# EasyEDA Pro project ACDC_双向.eprj, schematic 三相（TO-277）
Board Name: 三相（TO-277）; Create Date: 2025-07-25; Page Name: P1; Project Name: ACDC_双向; Schematic Name: Schematic3_2; Update Date: 2025-07-25; Company: 嘉立创EDA; Page Size: A4; Version: V1.0
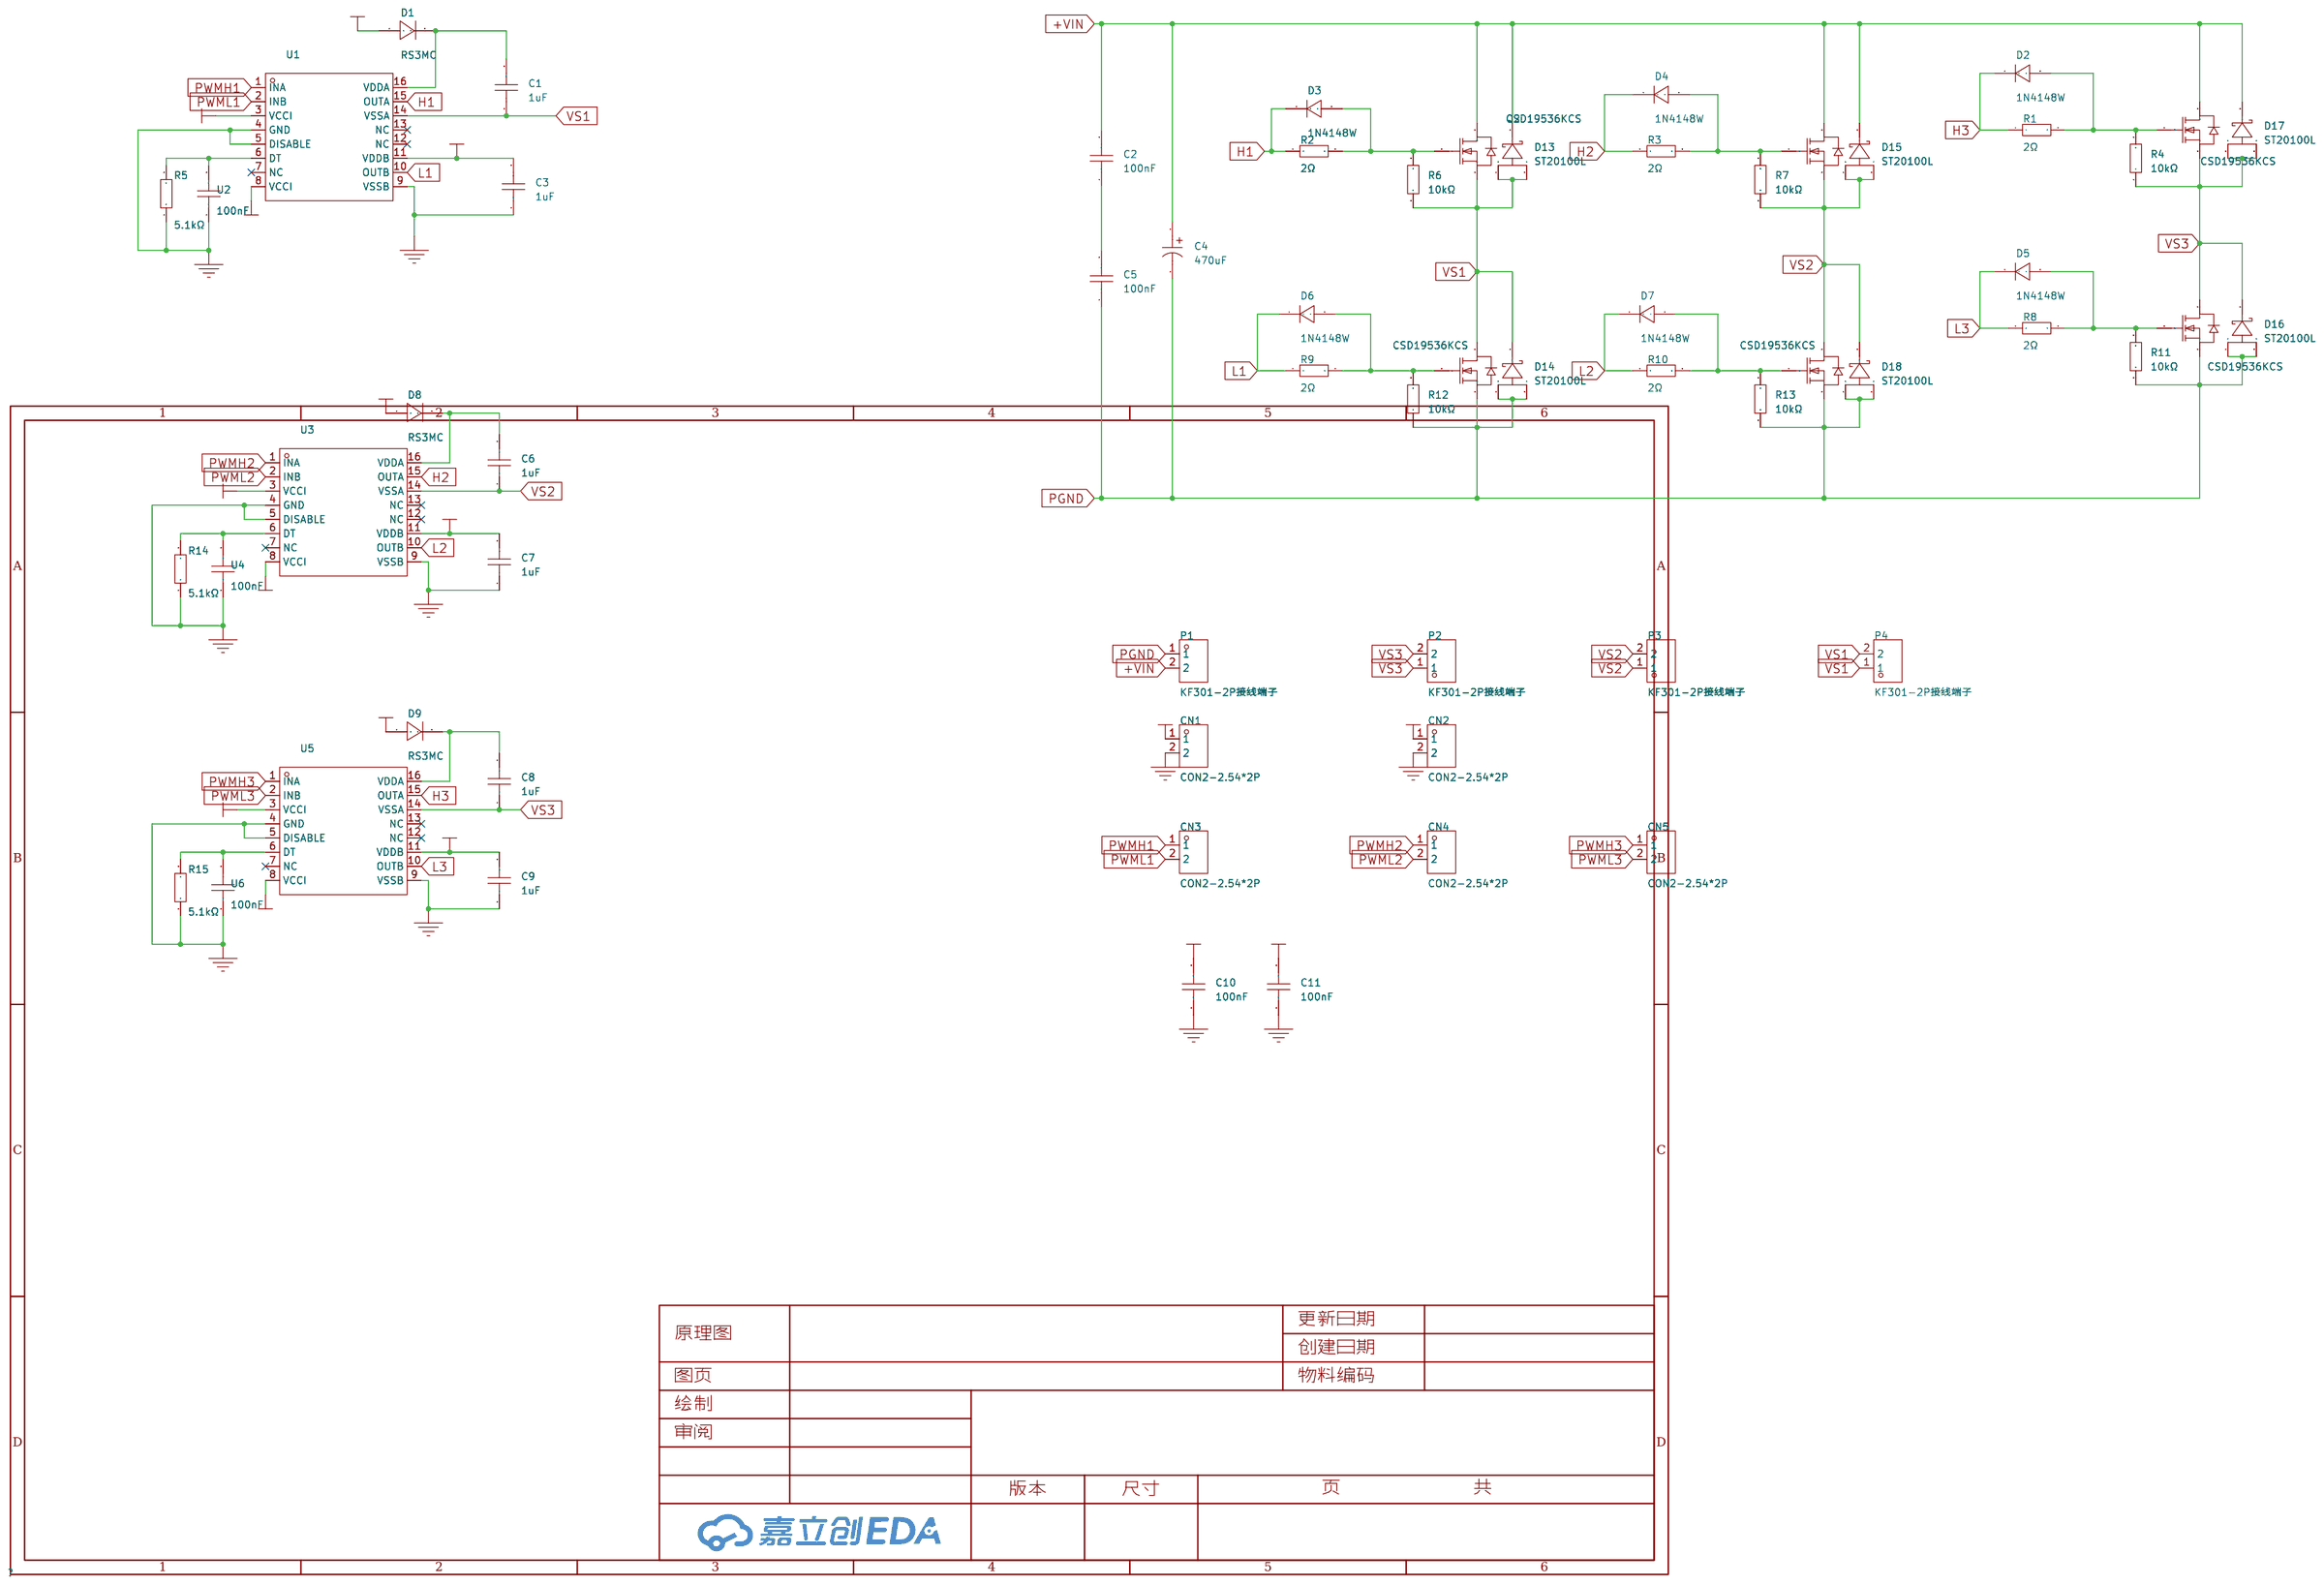
[diagram p3: schematic sheet]

## Parts
C1  1uF  [C0805]
C2  100nF  [C0805]
C3  1uF  [C0805]
C4  470uF  [CAP-TH_BD16.0-P7.50-D1.2-FD]
C5  100nF  [C0805]
C6  1uF  [C0805]
C7  1uF  [C0805]
C8  1uF  [C0805]
C9  1uF  [C0805]
C10  100nF  [C0805]
C11  100nF  [C0805]
CN1  CON2-2.54*2P  [CONN-TH_2P-P2.54-V]
CN2  CON2-2.54*2P  [CONN-TH_2P-P2.54-V]
CN3  CON2-2.54*2P  [CONN-TH_2P-P2.54-V]
CN4  CON2-2.54*2P  [CONN-TH_2P-P2.54-V]
CN5  CON2-2.54*2P  [CONN-TH_2P-P2.54-V]
D1  RS3MC  [SMC_L7.1-W6.2-LS8.1-R-RD]
D2  1N4148W  [SOD-123F_L2.7-W1.6-LS3.8-RD]
D3  1N4148W  [SOD-123F_L2.7-W1.6-LS3.8-RD]
D4  1N4148W  [SOD-123F_L2.7-W1.6-LS3.8-RD]
D5  1N4148W  [SOD-123F_L2.7-W1.6-LS3.8-RD]
D6  1N4148W  [SOD-123F_L2.7-W1.6-LS3.8-RD]
D7  1N4148W  [SOD-123F_L2.7-W1.6-LS3.8-RD]
D8  RS3MC  [SMC_L7.1-W6.2-LS8.1-R-RD]
D9  RS3MC  [SMC_L7.1-W6.2-LS8.1-R-RD]
D13  ST20100L  [TO-277_3P-L5.7-W4.2-LS6.5-BR]
D14  ST20100L  [TO-277_3P-L5.7-W4.2-LS6.5-BR]
D15  ST20100L  [TO-277_3P-L5.7-W4.2-LS6.5-BR]
D16  ST20100L  [TO-277_3P-L5.7-W4.2-LS6.5-BR]
D17  ST20100L  [TO-277_3P-L5.7-W4.2-LS6.5-BR]
D18  ST20100L  [TO-277_3P-L5.7-W4.2-LS6.5-BR]
P1  KF301-2P接线端子  [CONN-TH_XY301V-A-5.0-2P]
P2  KF301-2P接线端子  [CONN-TH_XY301V-A-5.0-2P]
P3  KF301-2P接线端子  [CONN-TH_XY301V-A-5.0-2P]
P4  KF301-2P接线端子  [CONN-TH_XY301V-A-5.0-2P]
Q1  CSD19536KCS  [TO-220-3_L10.0-W4.5-P2.54-L]
Q2  CSD19536KCS  [TO-220-3_L10.0-W4.5-P2.54-L]
Q3  CSD19536KCS  [TO-220-3_L10.0-W4.5-P2.54-L]
Q4  CSD19536KCS  [TO-220-3_L10.0-W4.5-P2.54-L]
Q5  CSD19536KCS  [TO-220-3_L10.0-W4.5-P2.54-L]
Q6  CSD19536KCS  [TO-220-3_L10.0-W4.5-P2.54-L]
R1  2Ω  [R0805]
R2  2Ω  [R0805]
R3  2Ω  [R0805]
R4  10kΩ  [R0805]
R5  20kΩ  [R0805]
R6  10kΩ  [R0805]
R7  10kΩ  [R0805]
R8  2Ω  [R0805]
R9  2Ω  [R0805]
R10  2Ω  [R0805]
R11  10kΩ  [R0805]
R12  10kΩ  [R0805]
R13  10kΩ  [R0805]
R14  20kΩ  [R0805]
R15  20kΩ  [R0805]
U1  UCC21520  [SOIC-16_L10.3-W7.5-P1.27-LS10.3-BL]
U2  100nF  [C0805]
U3  UCC21520  [SOIC-16_L10.3-W7.5-P1.27-LS10.3-BL]
U4  100nF  [C0805]
U5  UCC21520  [SOIC-16_L10.3-W7.5-P1.27-LS10.3-BL]
U6  100nF  [C0805]

## Library data of the parts
C1-C3 C5-C11 = CAP_0805: Supplier Footprint: 0805
C4 = CD11Z 100V470μF: LCSC Part Name: 470uF 100V; Supplier Part: C1692765; Manufacturer: DMEGC(东磁); Supplier Footprint: 插件,D16xL25mm; JLCPCB Part Class: 扩展库; Datasheet: https://atta.szlcsc.com/upload/public/pdf/source/20210111/C1692765_3DA9E861BF574BA4CB3EF792989E2CF7.pdf; Supplier: LCSC; Rated Voltage: 100V
CN1-CN5 = CON2-2.54*2P: Supplier Part: C9900003238; Supplier Footprint: TH-2P; JLCPCB Part Class: Extended Part; Supplier: LCSC
D1 D8 D9 = RS3MC_C15283: LCSC Part Name: 电压:1kV 电流:3A; Supplier Part: C15283; Manufacturer: MDD(辰达半导体); Supplier Footprint: SMC; JLCPCB Part Class: 扩展库; Datasheet: https://atta.szlcsc.com/upload/public/pdf/source/20240809/311FA8487617F5AA976E3BC15CA3A541.pdf; Supplier: LCSC; Diode Configuration: 独立式; Forward Voltage (Vf@If): 1.3V@3A; Reverse Voltage (Vr): 1kV; Rectified Current: 3A; Reverse Leakage Current: 5uA@1kV; Reverse Recovery Time (trr): 500ns; Operating Temperature: -55℃~+150℃@(Tj)
D2-D7 = 1N4148W_C81598: 二极管配置:独立式;正向压降(Vf):1V@50mA;直流反向耐压(Vr):75V;平均整流电流(Io):150mA;功率:400mW;反向恢复时间(trr):4ns;; LCSC Part Name: 电压:75V 电流:150mA; Supplier Part: C81598; Manufacturer: ST(先科); Supplier Footprint: SOD-123; JLCPCB Part Class: Basic Part; Datasheet: https://atta.szlcsc.com/upload/public/pdf/source/20161024/1477288446905.pdf; Supplier: LCSC; Diode Configuration: 独立式; Forward Voltage (Vf@If): 1V@50mA; Reverse Voltage (Vr): 75V; Average Rectified Current (Io): 150mA; Power Dissipation: 400mW; Reverse Leakage Current: 1uA@75V; Reverse Recovery Time (trr): 4ns
D13-D18 = ST20100L: LCSC Part Name: 电压:100V 电流:20A; Supplier Part: C2693410; Manufacturer: CJ(江苏长电/长晶); Supplier Footprint: TO-277; JLCPCB Part Class: 扩展库; Datasheet: https://atta.szlcsc.com/upload/public/pdf/source/20210330/C2693410_9551F5ED840A67394421895091158B3C.pdf; Supplier: LCSC; Diode Configuration: 独立式; Voltage - Forward(Vf@If): 650mV@20A; Voltage - DC Reverse(Vr): 100V; Current - Rectified: 20A; Reverse Leakage Current (Ir): 30uA@100V
P1-P4 = KF301-2P接线端子: Supplier Part: C9900016950; Supplier Footprint: CK301-2P; JLCPCB Part Class: 扩展库; Supplier: LCSC
Q1-Q6 = CSD19536KCS: 类型:1个N沟道;漏源电压(Vdss):100V;连续漏极电流(Id):150A;功率(Pd):375W;导通电阻(RDS(on)@Vgs,Id):2.7mΩ@10V,100A;阈值电压(Vgs(th)@Id):3.2V@250uA;; LCSC Part Name: 1个N沟道 耐压:100V 电流:150A; Supplier Part: C206030; Manufacturer: TI(德州仪器); Supplier Footprint: TO-220; JLCPCB Part Class: 扩展库; Datasheet: https://www.ti.com/cn/lit/gpn/csd19536kcs; Supplier: LCSC; Type: 1个N沟道; Drain Source Voltage (Vdss): 100V; Continuous Drain Current (Id): 150A; Power Dissipation (Pd): 375W; Drain Source On Resistance (RDS(on)@Vgs,Id): 2.7mΩ@10V,100A; Gate Threshold Voltage (Vgs(th)@Id): 3.2V@250uA; Total Gate Charge (Qg@Vgs): 153nC@10V; Input Capacitance (Ciss@Vds): 12nF@50V; Operating Temperature: -55℃~+175℃@(Tj)
R1-R4 R6-R13 = Res_AXIAL-1/8W: Supplier Footprint: 轴向引线
R5 R14 R15 = 20kΩ: 电阻类型:金属膜电阻;阻值:20kΩ;精度:±1%;功率:500mW;温度系数:±50ppm/℃;; LCSC Part Name: 金属膜电阻 20kΩ ±1% 500mW; Supplier Part: C173146; Manufacturer: YAGEO(国巨); Manufacturer Part: MFR50SFTE52-20K; Supplier Footprint: 插件,D2.4xL6.3mm; JLCPCB Part Class: 扩展库; Datasheet: https://atta.szlcsc.com/upload/public/pdf/source/20191118/C457825_18355E864DE4965678DC27B0EBC3E21E.pdf; Supplier: LCSC; Type: 金属膜电阻; Tolerance: ±1%; Power(Watts): 500mW; Temperature Coefficient: ±50ppm/℃; Operating Temperature Range: -55℃~+155℃; Origin Footprint 2: RES-TH_BD2.4-L6.3-P10.30-D0.6; Origin Footprint 1: MFR50SFTE52-20K
U1 U3 U5 = UCC21520: Supplier: LCSC; Supplier Part: C601651; Manufacturer: TI(德州仪器); JLCPCB Part Class: Extended Part
U2 U4 U6 = 1C25X7R473K100B: 容值:47nF;精度:±10%;额定电压:100V;温度系数:X7R;; LCSC Part Name: 47nF ±10% 100V; Supplier Part: C1630512; Manufacturer: VISHAY(威世); Supplier Footprint: 插件,P=6.35mm; JLCPCB Part Class: Extended Part; Datasheet: https://atta.szlcsc.com/upload/public/pdf/source/20210701/0CF1A7AD3406E72B391D35880AF61B15.pdf; Supplier: LCSC; Tolerance: ±10%; Voltage Rated: 100V; Temperature Coefficient: X7R

## Nets
+5V: C10.2 CN1.1 U1.3(VCCI) U1.8(VCCI) U3.3(VCCI) U3.8(VCCI) U5.3(VCCI) U5.8(VCCI)
+12V: C3.2 C7.2 C9.2 C11.2 CN2.1 D1.1(A) D8.1(A) D9.1(A) U1.11(VDDB) U3.11(VDDB) U5.11(VDDB)
+VIN: C2.2 C4.1 D13.2(K) D15.2(K) D17.2(K) P1.2 Q1.2(D) Q2.2(D) Q3.2(D)
DGND: C10.1 CN1.2 R5.1 R14.1 R15.1 U1.4(GND) U1.5(DISABLE) U2.1 U3.4(GND) U3.5(DISABLE) U4.1 U5.4(GND) U5.5(DISABLE) U6.1
PGND: C3.1 C4.2 C5.1 C7.1 C9.1 C11.1 CN2.2 D14.1(A) D14.3(A) D16.1(A) D16.3(A) D18.1(A) D18.3(A) P1.1 Q4.3(S) Q5.3(S) Q6.3(S) R11.1 R12.1 R13.1 U1.9(VSSB) U3.9(VSSB) U5.9(VSSB)
H1: D3.1(K) R2.1 U1.15(OUTA)
H2: D4.1(K) R3.1 U3.15(OUTA)
H3: D2.1(K) R1.1 U5.15(OUTA)
L1: D6.1(K) R9.1 U1.10(OUTB)
L2: D7.1(K) R10.1 U3.10(OUTB)
L3: D5.1(K) R8.1 U5.10(OUTB)
PWMH1: CN3.1 U1.1(INA)
PWMH2: CN4.1 U3.1(INA)
PWMH3: CN5.1 U5.1(INA)
PWML1: CN3.2 U1.2(INB)
PWML2: CN4.2 U3.2(INB)
PWML3: CN5.2 U5.2(INB)
VS1: C1.1 D13.1(A) D13.3(A) D14.2(K) P4.1 P4.2 Q2.3(S) Q5.2(D) R6.1 U1.14(VSSA)
VS2: C6.1 D15.1(A) D15.3(A) D18.2(K) P3.1 P3.2 Q3.3(S) Q6.2(D) R7.1 U3.14(VSSA)
VS3: C8.1 D16.2(K) D17.1(A) D17.3(A) P2.1 P2.2 Q1.3(S) Q4.2(D) R4.1 U5.14(VSSA)
$1N1727: D6.2(A) Q5.1(G) R9.2 R12.2
$1N1729: D3.2(A) Q2.1(G) R2.2 R6.2
$1N1731: D4.2(A) Q3.1(G) R3.2 R7.2
$1N1733: D7.2(A) Q6.1(G) R10.2 R13.2
$1N1740: R14.2 U3.6(DT) U4.2
$1N1748: R5.2 U1.6(DT) U2.2
$1N1758: C6.2 D8.2(K) U3.16(VDDA)
$1N1759: C1.2 D1.2(K) U1.16(VDDA)
$1N1779: C2.1 C5.2
$1N1953: D2.2(A) Q1.1(G) R1.2 R4.2
$1N2084: D5.2(A) Q4.1(G) R8.2 R11.2
$1N2554: R15.2 U5.6(DT) U6.2
$1N2562: C8.2 D9.2(K) U5.16(VDDA)

Not connected (* = marked no-connect by the designer): U1 7(NC)* 12(NC)* 13(NC)*; U3 7(NC)* 12(NC)* 13(NC)*; U5 7(NC)* 12(NC)* 13(NC)*
